# EAGLE design Teensy-Futurlec-Shield_v2 (EAGLE 6.2)
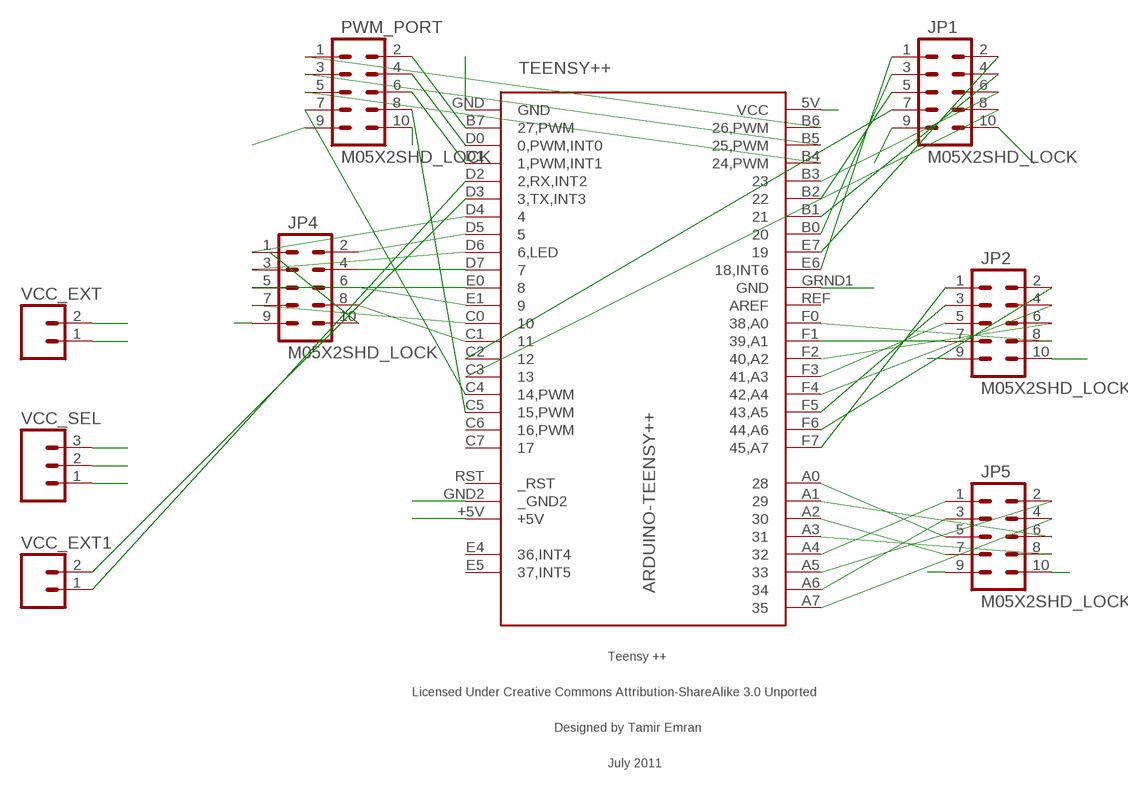
[diagram p0: schematic, sheet 1]

## Parts
JP1  M05X2SHD_LOCK  [2X5-SHROUDED_LOCK]
JP2  M05X2SHD_LOCK  [2X5-SHROUDED_LOCK]
JP4  M05X2SHD_LOCK  [2X5-SHROUDED_LOCK]
JP5  M05X2SHD_LOCK  [2X5-SHROUDED_LOCK]
PWM_PORT  M05X2SHD_LOCK  [2X5-SHROUDED_LOCK]
TEENSY++  ARDUINO-TEENSY++  [TEENSY++]
VCC_EXT  M02POLAR_LOCK  [MOLEX-1X2_LOCK]
VCC_EXT1  M02POLAR_LOCK  [MOLEX-1X2_LOCK]
VCC_SEL  M03PTH  [1X03]

## Nets
GND: JP1.10 JP2.10 JP4.10 JP5.10 PWM_PORT.10 TEENSY++.GND TEENSY++.GND2(_GND2) TEENSY++.GRND1(GND) VCC_EXT.2
N$1: PWM_PORT.1 TEENSY++.B6(26,PWM)
N$2: PWM_PORT.3 TEENSY++.B5(25,PWM)
N$3: PWM_PORT.5 TEENSY++.B4(24,PWM)
N$4: PWM_PORT.2 TEENSY++.B7(27,PWM)
N$5: PWM_PORT.4 TEENSY++.D0(0,PWM,INT0)
N$6: PWM_PORT.6 TEENSY++.D1(1,PWM,INT1)
N$7: PWM_PORT.8 TEENSY++.C5(15,PWM)
N$8: PWM_PORT.7 TEENSY++.C4(14,PWM)
N$9: JP2.8 TEENSY++.F0(38,A0)
N$10: JP2.7 TEENSY++.F1(39,A1)
N$11: JP2.6 TEENSY++.F2(40,A2)
N$12: JP2.5 TEENSY++.F3(41,A3)
N$13: JP2.4 TEENSY++.F4(42,A4)
N$14: JP2.3 TEENSY++.F5(43,A5)
N$15: JP2.2 TEENSY++.F6(44,A6)
N$16: JP2.1 TEENSY++.F7(45,A7)
N$17: JP5.1 TEENSY++.A4
N$18: JP1.1 TEENSY++.E6(18,INT6)
N$19: JP1.2 TEENSY++.E7
N$20: JP1.3 TEENSY++.B0
N$21: JP1.4 TEENSY++.B1
N$22: JP1.5 TEENSY++.B2
N$23: JP1.6 TEENSY++.B3
N$24: JP4.5 TEENSY++.E0
N$25: JP4.1 TEENSY++.D4
N$26: JP4.2 TEENSY++.D5
N$27: JP4.6 TEENSY++.E1
N$28: JP1.7 TEENSY++.C2
N$29: JP4.7 TEENSY++.C0
N$30: JP4.8 TEENSY++.C1
N$31: JP4.3 TEENSY++.D6(6,LED)
N$32: JP4.4 TEENSY++.D7
N$33: JP1.8 TEENSY++.C3
N$34: JP5.2 TEENSY++.A5
N$35: JP5.3 TEENSY++.A6
N$36: JP5.4 TEENSY++.A7
N$37: JP5.5 TEENSY++.A0
N$38: JP5.6 TEENSY++.A1
N$39: JP5.7 TEENSY++.A2
N$40: JP5.8 TEENSY++.A3
N$41: TEENSY++.D2(2,RX,INT2) VCC_EXT1.1
N$42: TEENSY++.D3(3,TX,INT3) VCC_EXT1.2
VCC: JP1.9 JP2.9 JP4.9 JP5.9 PWM_PORT.9 VCC_SEL.2
VCC_EXT: VCC_EXT.1 VCC_SEL.3
VCC_TEENSY: TEENSY++.5V(VCC) TEENSY++.+5V VCC_SEL.1
Unconnected: TEENSY++.C6(16,PWM) TEENSY++.C7 TEENSY++.E4(36,INT4) TEENSY++.E5(37,INT5) TEENSY++.REF(AREF) TEENSY++.RST(_RST)

## Library data of the parts
JP1 JP2 JP4 JP5 PWM_PORT = SparkFun:M05X2: Header 5x2 Standard 10-pin dual row 0.1" header. Commonly used with AVR-ISP. Use with Spark Fun Electronics SKU: PRT-00778
TEENSY++ = teensypp:ARDUINO-TEENSY++: Teensy ++ Original Design by Mark Gross Modified Design by Tamir Emran Licensed Under Creative Commons Attribution-ShareAlike 3.0 Unported (CC BY-SA 3.0)
VCC_EXT VCC_EXT1 = SparkFun:M02: Header 2 Standard 2-pin 0.1" header. Use with straight break away headers (SKU : PRT-00116), right angle break away headers (PRT-00553), swiss pins (PRT-00743), machine pins (PRT-00117), and female headers (PRT-00115). Molex polarized connector foot print use with SKU : PRT-08233 with associated crimp pins and housings.
VCC_SEL = SparkFun:M03: Header 3 Standard 3-pin 0.1" header. Use with straight break away headers (SKU : PRT-00116), right angle break away headers (PRT-00553), swiss pins (PRT-00743), machine pins (PRT-00117), and female headers (PRT-00115). Molex polarized connector foot print use with SKU : PRT-08232 with associated crimp pins and housings.

## Board
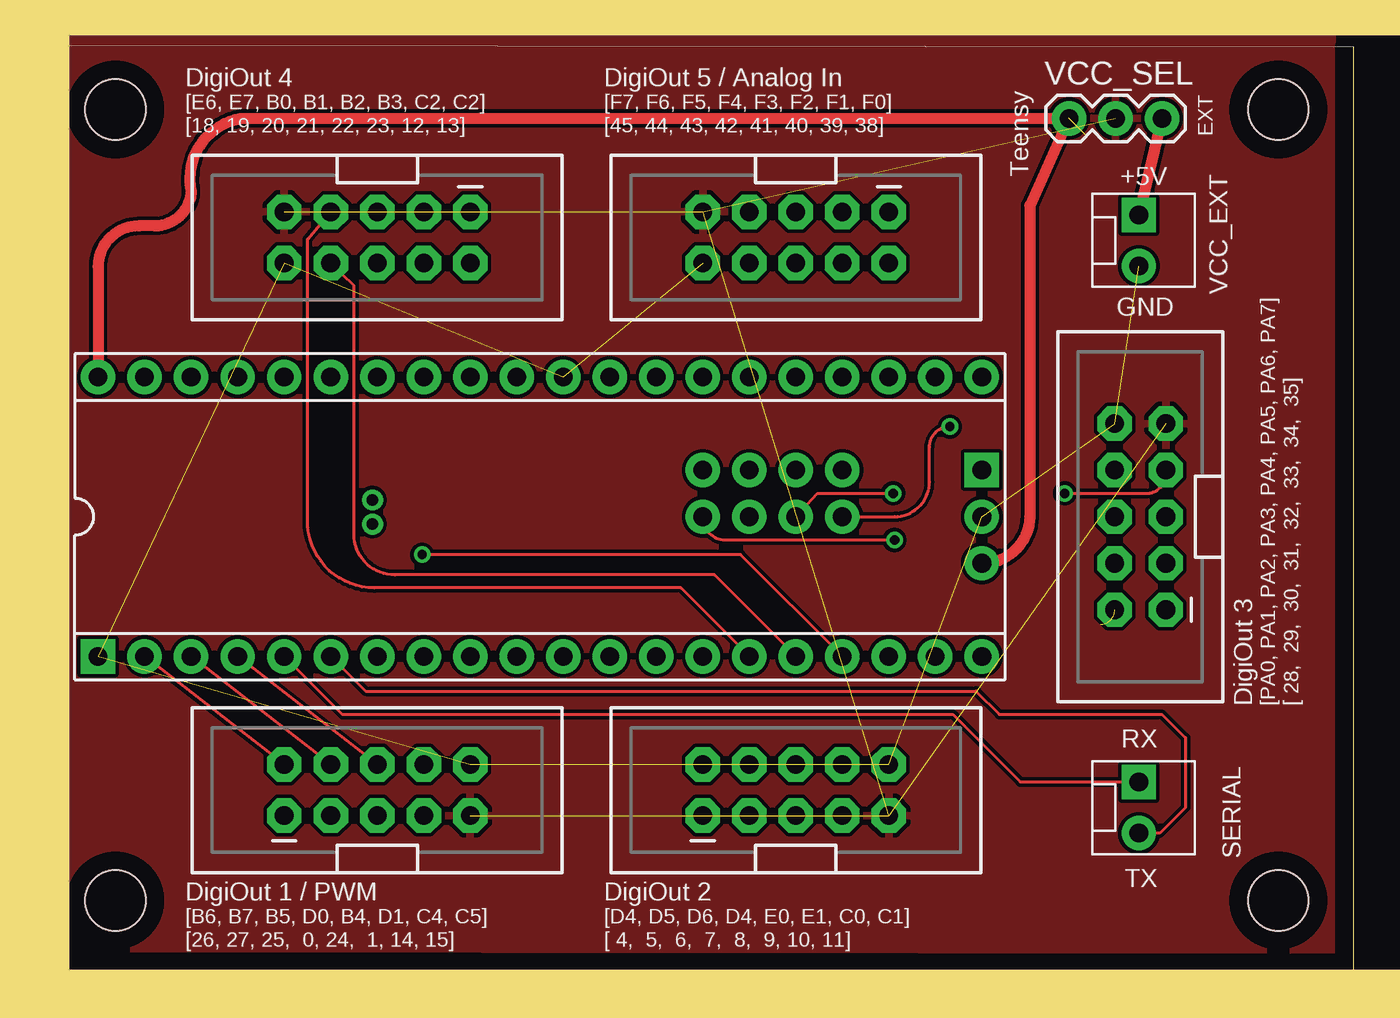
[diagram p1: board, top side]
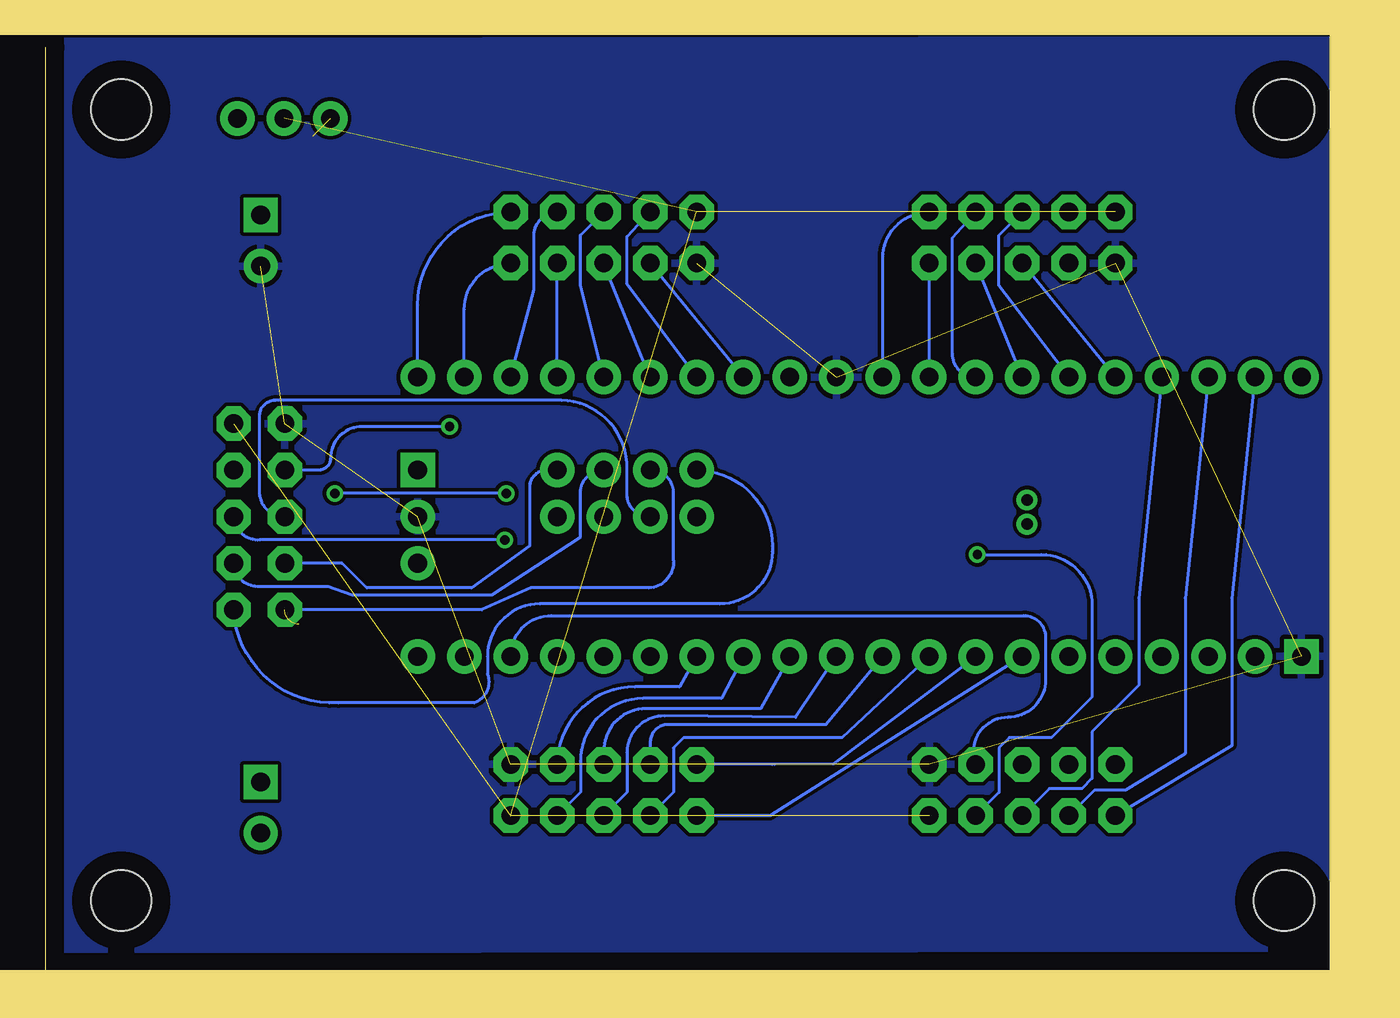
[diagram p2: board, bottom side, seen from below]

Size 71.43 x 50.55 mm. Coordinates in mm from the lower left corner, seen from the top.
Outline: 71.43,50.47 71.43,0 0,0.08 0,50.55
Copper layers (1*16): Top 0.035mm / dielectric 1.5mm / Bottom 0.035mm
Design rules: minimum track width 10mil, minimum drill 24mil, track to track 8mil, track to pad 8mil, pad to pad 8mil, via to via 8mil, smd to smd 8mil, copper to edge 40mil, drill to drill 8mil, minimum pad ring 10mil, minimum via ring 8mil, stop-mask expansion 4mil, vias tented up to drill 0mil, thermal gap 10mil
Holes 3.3 mm at 67.31,47.07 67.31,3.89 3.81,3.89 3.81,47.07
Milling: 4 lines

### Footprints (pad centres in the part's own frame; a part is rotated, then mirrored left to right if it is on the bottom)
2X5-SHROUDED_LOCK = drill 1.016 pad 1.88 octagon: 1 -1.397,5.08; 2 1.397,5.08; 3 -1.397,2.54; 4 1.397,2.54; 5 -1.397,0; 6 1.397,0; 7 -1.397,-2.54; 8 1.397,-2.54; 9 -1.397,-5.08; 10 1.397,-5.08
TEENSY++ = drill 1.016 pad 1.88: 5V 24.13,-2.54; +5V -24.13,7.62; A0 8.89,0; A1 11.43,0; A2 13.97,0; A3 16.51,0; A4 8.89,2.54; A5 11.43,2.54; A6 13.97,2.54; A7 16.51,2.54; B0 -6.35,7.62; B1 -8.89,7.62; B2 -11.43,7.62; B3 -13.97,7.62; B4 -16.51,7.62; B5 -19.05,7.62; B6 -21.59,7.62; B7 -21.59,-7.62; C0 6.35,-7.62; C1 8.89,-7.62; C2 11.43,-7.62; C3 13.97,-7.62; C4 16.51,-7.62; C5 19.05,-7.62; C6 21.59,-7.62; C7 24.13,-7.62; D0 -19.05,-7.62; D1 -16.51,-7.62; D2 -13.97,-7.62; D3 -11.43,-7.62; D4 -8.89,-7.62; D5 -6.35,-7.62; D6 -3.81,-7.62; D7 -1.27,-7.62; E0 1.27,-7.62; E1 3.81,-7.62; E6 -1.27,7.62; E7 -3.81,7.62; F0 6.35,7.62; F1 8.89,7.62; F2 11.43,7.62; F3 13.97,7.62; F4 16.51,7.62; F5 19.05,7.62; F6 21.59,7.62; F7 24.13,7.62; GND2 24.13,0; GRND1 1.27,7.62; REF 3.81,7.62 | drill 0.635 pad 1.067: E4 -9.144,0.914; E5 -9.144,-0.406 | drill 1.016 pad 1.88 square: GND -24.13,-7.62; RST 24.13,2.54
MOLEX-1X2_LOCK = drill 1.016 pad 1.88 square: 1 -0.127,0 | drill 1.016 pad 1.88: 2 2.667,0
1X03 = drill 1.016 pad 1.88: 1 0,0; 2 2.54,0; 3 5.08,0

### Placement (x,y rotation side)
JP1  18.1,40.08 270 top
JP2  40.96,40.08 270 top
JP4  40.96,9.92 90 top
JP5  59.77,24.84 180 top
PWM_PORT  18.1,9.92 90 top
TEENSY++  26.99,24.84 0 top
VCC_EXT  59.69,41.2 270 top
VCC_EXT1  59.69,10.24 270 top
VCC_SEL  55.88,46.59 0 top

### Tracks (layer width: path | path; a pad name or v marks a point on that pad's centre or on a via)
GND  (8 unrouted)
  pour Bottom: 0,50.88 71.36,50.8 71.36,0 0,0.08
N$1
  Bottom 0.152: TEENSY++.B6 6.67,20.4 6.67,12.33 PWM_PORT.1
N$2
  Bottom 0.152: TEENSY++.B5 9.21,20.4 9.21,11.91 12.46,9.92 14.16,9.92 PWM_PORT.3
N$3
  Bottom 0.152: TEENSY++.B4 11.75,20.4 11.75,15.64 14.29,13.1 14.29,10.56 14.84,10 16.62,10 PWM_PORT.5
N$4
  Top 0.152: TEENSY++.B7 PWM_PORT.2
N$5
  Top 0.152: TEENSY++.D0 PWM_PORT.4
N$6
  Top 0.152: TEENSY++.D1 PWM_PORT.6
N$7
  Bottom 0.152: TEENSY++.C5 arc90 43.81,19.45 18.02,19.45 arc90 16.83,18.26 16.83,15.95 arc90 18.89,13.89 arc-112 PWM_PORT.8
N$8  (via drill 0.5)
  Top 0.152: TEENSY++.C4 37.94,22.78 v20.56,22.78
  Bottom 0.152: v20.56,22.78 17.07,22.78 arc90 14.29,20 14.29,15 16.51,12.78 18.81,12.78 19.37,12.22 19.37,9.8 PWM_PORT.7
N$9
  Bottom 0.152: TEENSY++.F0 JP2.8
N$10
  Bottom 0.152: TEENSY++.F1 39.69,37.54 39.69,40.13 JP2.7
N$11
  Bottom 0.152: TEENSY++.F2 JP2.6
N$12
  Bottom 0.152: TEENSY++.F3 42.23,37.47 42.23,40.21 JP2.5
N$13
  Bottom 0.152: TEENSY++.F4 JP2.4
N$14
  Bottom 0.152: TEENSY++.F5 44.77,37.23 44.77,40.13 arc90 JP2.3
N$15
  Bottom 0.152: TEENSY++.F6 48.58,36.15 arc90 JP2.2
N$16
  Bottom 0.152: TEENSY++.F7 51.12,36.4 arc90 JP2.1
N$17
  Bottom 0.152: TEENSY++.A4 arc90 31.75,23.26 31.75,22.94 arc90 34.61,20.08 44.45,20.08 arc-90 47.31,17.22 47.31,16.27 arc90 48.02,14.68 55.45,14.68 arc90 JP5.1
N$18
  Bottom 0.152: TEENSY++.E6 25.72,38.94 arc90 JP1.1
N$19
  Bottom 0.152: TEENSY++.E7 JP1.2
N$20
  Bottom 0.152: TEENSY++.B0 arc90 21.91,33.73 21.91,40.08 JP1.3
N$21
  Bottom 0.152: TEENSY++.B1 JP1.4
N$22
  Bottom 0.152: TEENSY++.B2 19.37,37.47 19.37,40.21 JP1.5
N$23
  Bottom 0.152: TEENSY++.B3 JP1.6
N$24
  Bottom 0.152: JP4.5 39.69,9.8 39.69,11.99 arc90 37.62,13.97 30.48,13.89 TEENSY++.E0
N$25
  Bottom 0.152: TEENSY++.D4 31.88,8.52 JP4.1
N$26
  Bottom 0.152: 31.62,11.32 31.75,11.32 | 31.75,11.32 JP4.2 | TEENSY++.D5 28.42,11.35 31.75,11.32
N$27
  Bottom 0.152: JP4.6 40.96,12.07 arc90 38.66,14.37 32.38,14.37 TEENSY++.E1
N$28
  Top 0.152: TEENSY++.C2 34.69,20.96 17.94,20.96 arc-90 14.29,24.61 14.29,40.01 JP1.7 15.53,41.48
N$29
  Bottom 0.152: TEENSY++.C0 34.53,14.92 38.81,14.92 arc-90 42.23,11.51 42.23,9.8 JP4.7
N$30
  Bottom 0.152: TEENSY++.C1 36.83,15.56 39.26,15.56 arc-90 JP4.8
N$31
  Bottom 0.152: JP4.3 37.15,9.8 37.15,12.22 36.59,12.78 27.94,12.78 TEENSY++.D6
N$32
  Bottom 0.152: JP4.4 38.42,12.54 arc90 37.46,13.49 28.81,13.49 TEENSY++.D7
N$33
  Top 0.152: TEENSY++.C3 36.51,21.67 19.05,21.67 arc-90 16.83,23.89 16.83,37.47 JP1.8
N$34  (1 unrouted)
  Bottom 0.152: TEENSY++.A5 arc90 37.15,26.19 37.15,22.46 arc90 38.5,20.96 44.93,20.96 47.62,19.76 JP5.2
N$35
  Bottom 0.152: JP5.3 arc-91 59.73,21.03 56,21.03 54.69,20.56 47.07,20.56 42.23,23.73 42.23,26.19 arc90 TEENSY++.A6
N$36
  Bottom 0.152: TEENSY++.A7 43.81,27.38 arc-90 45.01,26.59 45.01,23.26 48.18,20.96 53.9,20.96 55.24,22.3 JP5.4
N$37  (via drill 0.5)
  Top 0.152: TEENSY++.A0 arc90 37.07,23.57 v46.35,23.57
  Bottom 0.152: v46.35,23.57 59.74,23.57 arc90 JP5.5
N$38
  Bottom 0.152: TEENSY++.A1 arc90 39.69,26.04 39.69,27.46 arc-90 43.26,31.19 58.9,31.19 arc-90 59.77,30.32 59.77,26.24 arc-90 JP5.6
N$39  (via drill 0.5)
  Top 0.152: TEENSY++.A2 42.15,26.11 v46.28,26.11 | v55.64,26.11 60.21,26.11 arc90 JP5.7
  Bottom 0.152: v46.28,26.11 v55.64,26.11
N$40  (via drill 0.5)
  Top 0.152: TEENSY++.A3 46.35,24.84 arc90 48.26,26.75 48.26,28.65 arc-90 v49.37,29.77
  Bottom 0.152: v49.37,29.77 54.13,29.77 arc-90 55.88,28.02 arc90 56.52,27.38 JP5.8
N$41
  Top 0.152: TEENSY++.D2 16.19,14.05 49.53,14.05 53.21,10.37 VCC_EXT1.1
N$42
  Top 0.152: TEENSY++.D3 17.46,15.32 50.8,15.32 52.07,14.05 60.96,14.05 62.23,12.78 62.23,8.97 60.83,7.57 VCC_EXT1.2
VCC  (5 unrouted)
  pour Top: 0,50.88 71.44,50.88 71.44,0.08 0,0.08
VCC_EXT
  Top 0.61: VCC_SEL.3 VCC_EXT.1
VCC_TEENSY  (1 unrouted)
  Top 0.61: TEENSY++.5V arc90 53.74,24.84 53.74,41.83 VCC_SEL.1 10.64,46.59 arc90 7.94,42.7 arc-90 5.95,40.72 5.08,40.72 arc90 2.86,38.5 TEENSY++.+5V

### Text on the board
_tsilk: DigiOut 4 | DigiOut 5 / Analog In | [E6, E7, B0, B1, B2, B3, C2, C2] | [F7, F6, F5, F4, F3, F2, F1, F0] | [18, 19, 20, 21, 22, 23, 12, 13] | [45, 44, 43, 42, 41, 40, 39, 38] | EXT | Teensy | +5V | GND | VCC_EXT | DigiOut 3 | [PA0, PA1, PA2, PA3, PA4, PA5, PA6, PA7] | [ 28, 29, 30, 31, 32, 33, 34, 35] | RX | TX | SERIAL | DigiOut 1 / PWM | DigiOut 2 | [B6, B7, B5, D0, B4, D1, C4, C5] | [D4, D5, D6, D4, E0, E1, C0, C1] | [26, 27, 25, 0, 24, 1, 14, 15] | [ 4, 5, 6, 7, 8, 9, 10, 11]